# Altium schematic sheet PROC099B_LP Connector.SchDoc: LP Connector
size 431 x 279 mm; Date: Not shown in title block; ApprovedBy: Not shown in title block; CheckedBy: Not shown in title block; Author: Not shown in title block; CompanyName: Not shown in title block; DrawnBy: Adrian Ozer; Engineer: Not shown in title block; Organization: Not shown in title block; Address1: Not shown in title block; Address2: Not shown in title block; Address3: Not shown in title block; Address4: Not shown in title block; DocumentNumber: 11; Revision: Use project parameter SCH_Rev; SheetNumber: 11; SheetTotal: 16; PageSetup: Record=PageOptions|CenterHorizontal=True|CenterVertical=True|PrintScale=1.00|XCorrection=1.00|YCorrection=1.00|PrintKind=0|BorderSize=5000000|LeftOffset=0|BottomOffset=0|Orientation=2|PaperLength=1000|PaperWidth=1000|Scale=100|PaperSource=15|PrintQuality=600|MediaType=1|DitherType=10|PaperKind=Letter|PrintScaleMode=1; CurrentTime: Not shown in title block; CurrentDate: Not shown in title block; Time: Not shown in title block; DocumentFullPathAndName: Not shown in title block; DocumentName: Not shown in title block; ModifiedDate: Not shown in title block; ImagePath: Not shown in title block
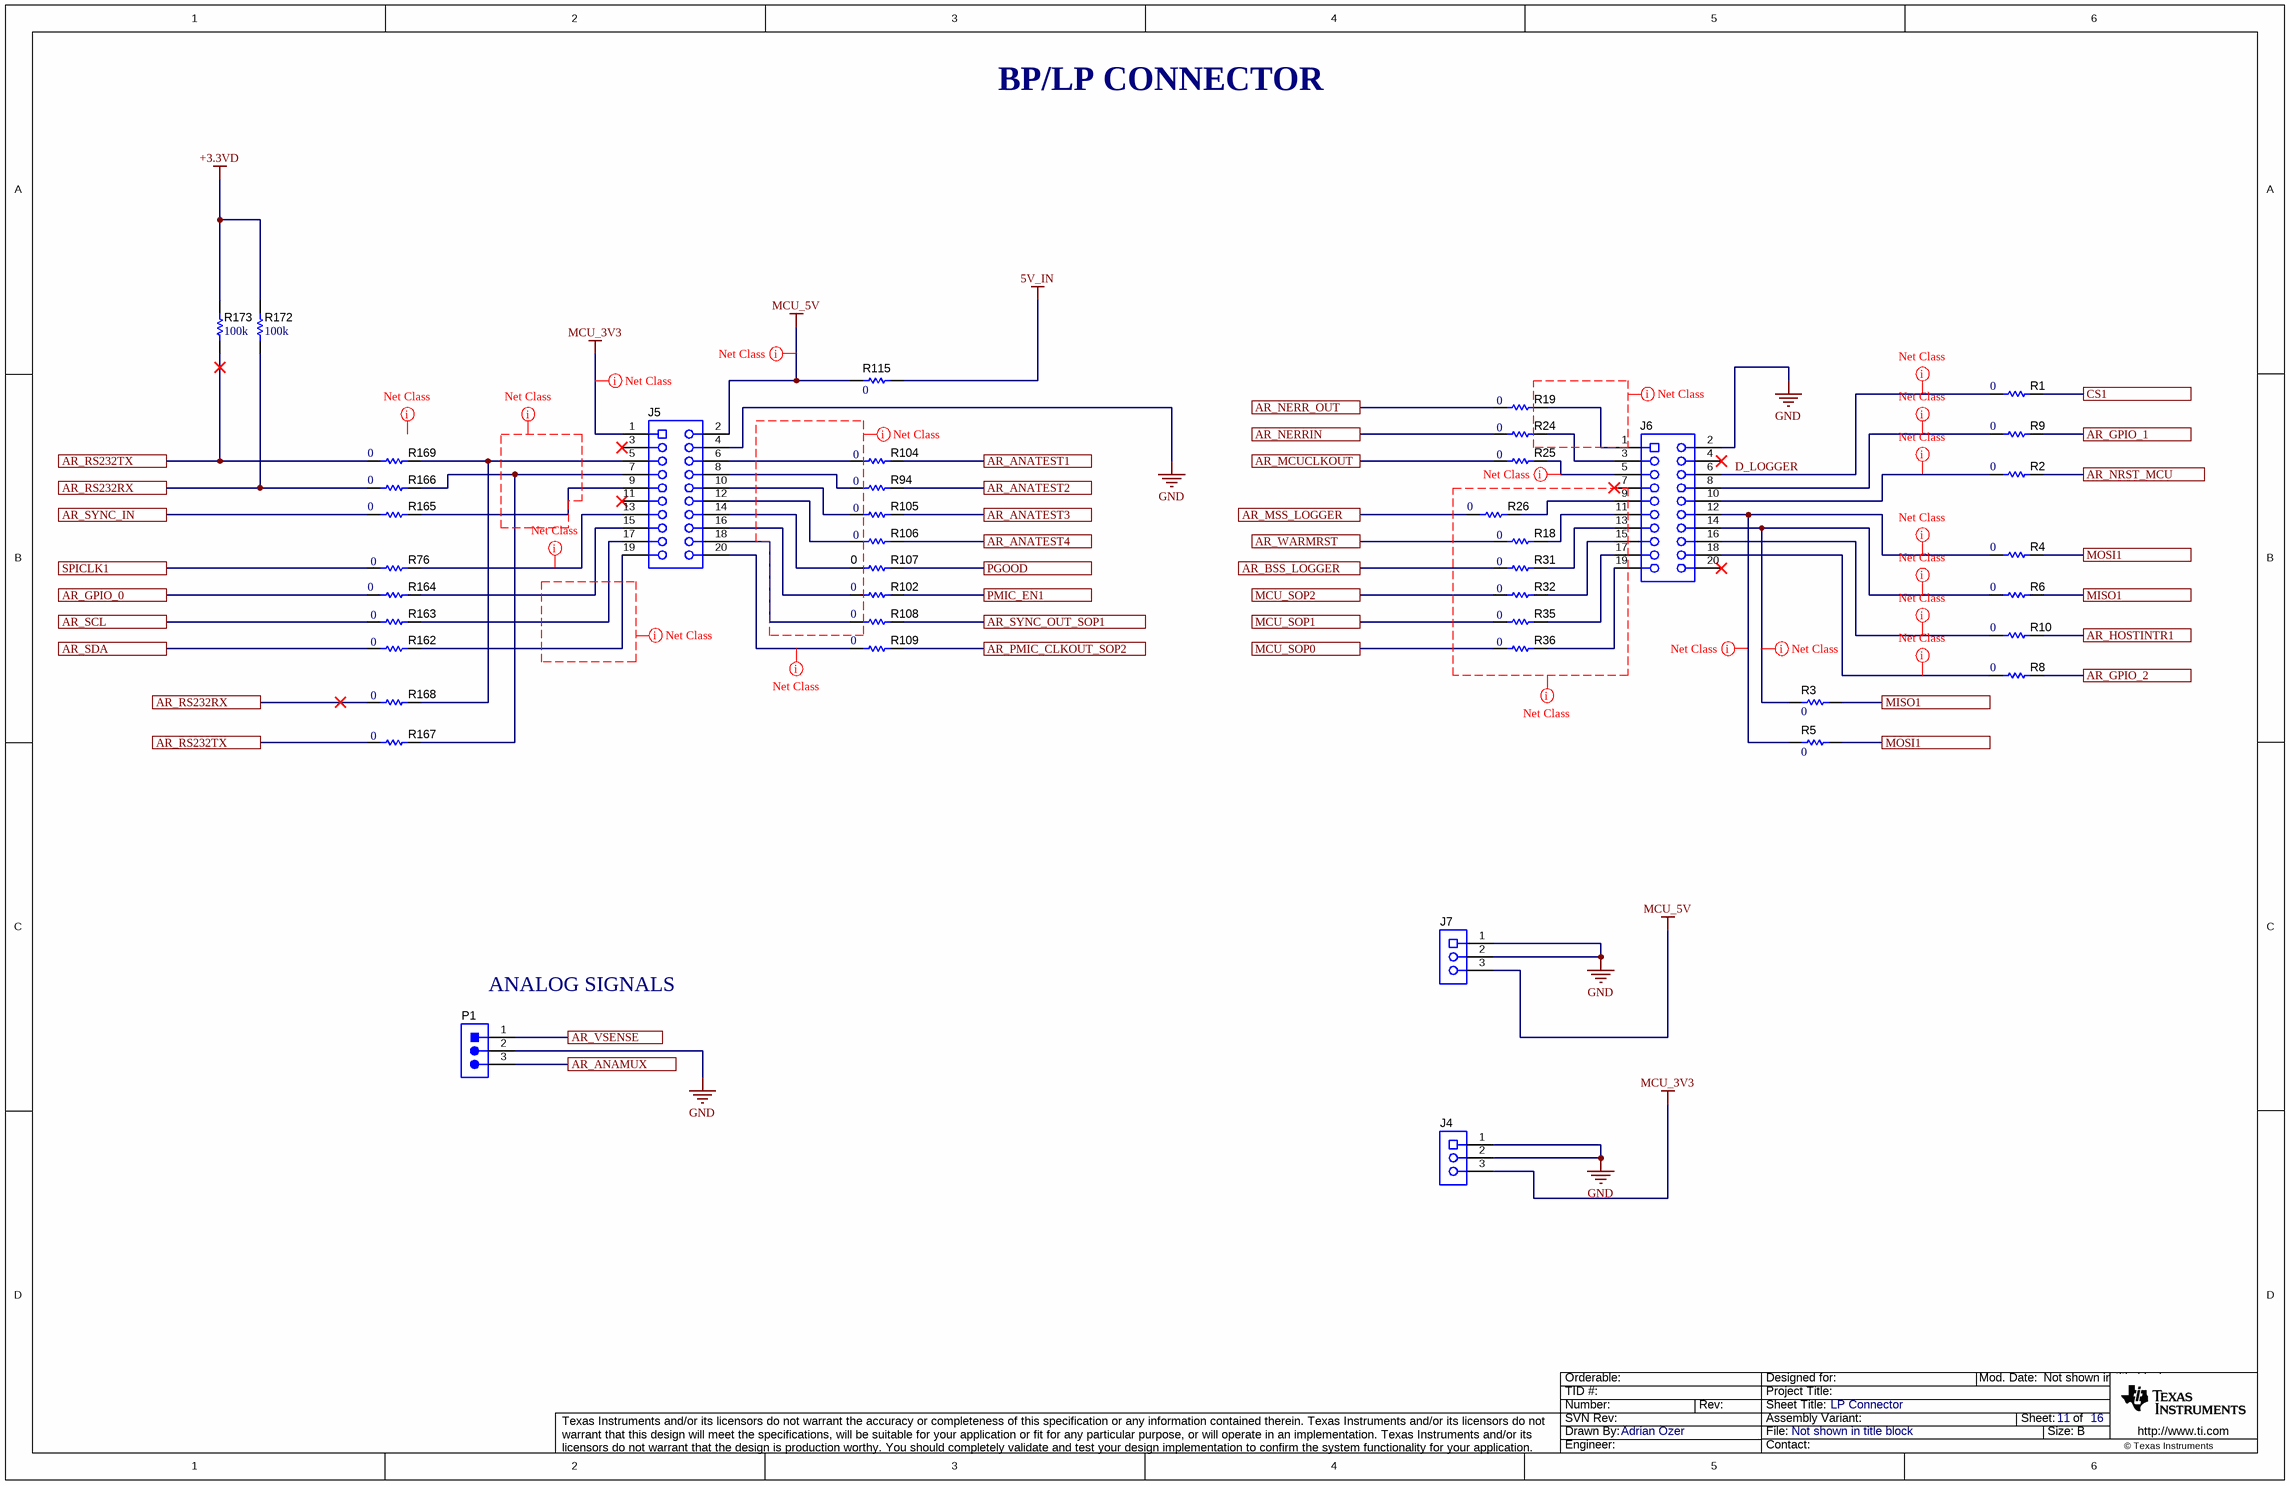
[diagram p0: PROC099B_LP Connector.SchDoc]

## Parts
J4  SSM-103-S-SV  [Samtec_SSM-103-x-SV]  (value not drawn)
J5  SSM-110-S-DV  [Samtec_SSM-110-x-DV]  (value not drawn)
J6  SSM-110-S-DV  [Samtec_SSM-110-x-DV]  (value not drawn)
J7  SSM-103-S-SV  [Samtec_SSM-103-x-SV]  (value not drawn)
P1  TSW-103-07-T-S  [Samtec_TSW-103-07-T-S]  (value not drawn)
R1  ValueDisplayed: 0  [0201_Silk]  (hidden comment: CRCW02010000Z0ED)
R2  ValueDisplayed: 0  [0201_Silk]  (hidden comment: CRCW02010000Z0ED)
R3  ValueDisplayed: 0  [0201_Silk]  (hidden comment: CRCW02010000Z0ED)
R4  ValueDisplayed: 0  [0201_Silk]  (hidden comment: CRCW02010000Z0ED)
R5  ValueDisplayed: 0  [0201_Silk]  (hidden comment: CRCW02010000Z0ED)
R6  ValueDisplayed: 0  [0201_Silk]  (hidden comment: CRCW02010000Z0ED)
R8  ValueDisplayed: 0  [0201_Silk]  (hidden comment: CRCW02010000Z0ED)
R9  ValueDisplayed: 0  [0201_Silk]  (hidden comment: CRCW02010000Z0ED)
R10  ValueDisplayed: 0  [0201_Silk]  (hidden comment: CRCW02010000Z0ED)
R18  ValueDisplayed: 0  [0201_Silk]  (hidden comment: CRCW02010000Z0ED)
R19  ValueDisplayed: 0  [0201_Silk]  (hidden comment: CRCW02010000Z0ED)
R24  ValueDisplayed: 0  [0201_Silk]  (hidden comment: CRCW02010000Z0ED)
R25  ValueDisplayed: 0  [0201_Silk]  (hidden comment: CRCW02010000Z0ED)
R26  ValueDisplayed: 0  [0201_Silk]  (hidden comment: CRCW02010000Z0ED)
R31  ValueDisplayed: 0  [0201_Silk]  (hidden comment: CRCW02010000Z0ED)
R32  ValueDisplayed: 0  [0201_Silk]  (hidden comment: CRCW02010000Z0ED)
R35  ValueDisplayed: 0  [0201_Silk]  (hidden comment: CRCW02010000Z0ED)
R36  ValueDisplayed: 0  [0201_Silk]  (hidden comment: CRCW02010000Z0ED)
R76  ValueDisplayed: 0  [0201_Silk]  (hidden comment: CRCW02010000Z0ED)
R94  ValueDisplayed: 0  [0201_Silk]  (hidden comment: CRCW02010000Z0ED)
R102  ValueDisplayed: 0  [0201_Silk]  (hidden comment: CRCW02010000Z0ED)
R104  ValueDisplayed: 0  [0201_Silk]  (hidden comment: CRCW02010000Z0ED)
R105  ValueDisplayed: 0  [0201_Silk]  (hidden comment: CRCW02010000Z0ED)
R106  ValueDisplayed: 0  [0201_Silk]  (hidden comment: CRCW02010000Z0ED)
R107  ValueDisplayed: 0  [0402L]  (hidden comment: ERJ-2GE0R00X)
R108  ValueDisplayed: 0  [0201_Silk]  (hidden comment: CRCW02010000Z0ED)
R109  ValueDisplayed: 0  [0201_Silk]  (hidden comment: CRCW02010000Z0ED)
R115  ValueDisplayed: 0  [2010]  (hidden comment: CRCW20100000Z0EF)
R162  ValueDisplayed: 0  [0201_Silk]  (hidden comment: CRCW02010000Z0ED)
R163  ValueDisplayed: 0  [0201_Silk]  (hidden comment: CRCW02010000Z0ED)
R164  ValueDisplayed: 0  [0201_Silk]  (hidden comment: CRCW02010000Z0ED)
R165  ValueDisplayed: 0  [0201_Silk]  (hidden comment: CRCW02010000Z0ED)
R166  ValueDisplayed: 0  [0201_Silk]  (hidden comment: CRCW02010000Z0ED)
R167  ValueDisplayed: 0  [0201_Silk]  (hidden comment: CRCW02010000Z0ED)
R168  ValueDisplayed: 0  [0201_Silk]  (hidden comment: CRCW02010000Z0ED)
R169  ValueDisplayed: 0  [0201_Silk]  (hidden comment: CRCW02010000Z0ED)
R172  ValueDisplayed: 100k  [0402L]  (hidden comment: CRCW0402100KFKED)
R173  ValueDisplayed: 100k  [0402L]  (hidden comment: CRCW0402100KFKED)

## Ports
AR_ANAMUX, AR_ANATEST1, AR_ANATEST2, AR_ANATEST3, AR_ANATEST4, AR_BSS_LOGGER, AR_GPIO_0, AR_GPIO_1, AR_GPIO_2, AR_HOSTINTR1, AR_MCUCLKOUT, AR_MSS_LOGGER, AR_NERR_OUT, AR_NERRIN, AR_NRST_MCU, AR_PMIC_CLKOUT_SOP2, AR_RS232RX, AR_RS232TX, AR_SCL, AR_SDA, AR_SYNC_IN, AR_SYNC_OUT_SOP1, AR_VSENSE, AR_WARMRST, CS1, MCU_SOP0, MCU_SOP1, MCU_SOP2, MISO1, MOSI1, PGOOD, PMIC_EN1, SPICLK1

## Nets
5V_IN: R115.2
+3.3VD: R172.2 R173.2
GND: J4.1 J4.2 J5.4 J6.2 J7.1 J7.2 P1.2
MCU_3V3: J4.3 J5.1
MCU_5V: J5.2 J7.3 R115.1
AR_ANAMUX: P1.3 ; port AR_ANAMUX
AR_ANATEST1: R104.2 ; port AR_ANATEST1
AR_ANATEST2: R94.2 ; port AR_ANATEST2
AR_ANATEST3: R105.2 ; port AR_ANATEST3
AR_ANATEST4: R106.2 ; port AR_ANATEST4
AR_BSS_LOGGER: R31.1 ; port AR_BSS_LOGGER
AR_GPIO_0: R164.1 ; port AR_GPIO_0
AR_GPIO_1: R9.2 ; port AR_GPIO_1
AR_GPIO_2: R8.2 ; port AR_GPIO_2
AR_HOSTINTR1: R10.2 ; port AR_HOSTINTR1
AR_MCUCLKOUT: R25.1 ; port AR_MCUCLKOUT
AR_MSS_LOGGER: R26.1 ; port AR_MSS_LOGGER
AR_NERR_OUT: R19.1 ; port AR_NERR_OUT
AR_NERRIN: R24.1 ; port AR_NERRIN
AR_NRST_MCU: R2.2 ; port AR_NRST_MCU
AR_PMIC_CLKOUT_SOP2: R109.2 ; port AR_PMIC_CLKOUT_SOP2
AR_RS232RX: R166.1 R168.1 R172.1 ; port AR_RS232RX
AR_RS232TX: R167.1 R169.1 R173.1 ; port AR_RS232TX
AR_SCL: R163.1 ; port AR_SCL
AR_SDA: R162.1 ; port AR_SDA
AR_SYNC_IN: R165.1 ; port AR_SYNC_IN
AR_SYNC_OUT_SOP1: R108.2 ; port AR_SYNC_OUT_SOP1
AR_VSENSE: P1.1 ; port AR_VSENSE
AR_WARMRST: R18.1 ; port AR_WARMRST
CS1: R1.2 ; port CS1
D_LOGGER: J6.6 R1.1
MCU_SOP0: R36.1 ; port MCU_SOP0
MCU_SOP1: R35.1 ; port MCU_SOP1
MCU_SOP2: R32.1 ; port MCU_SOP2
MISO1: R3.2 R6.2 ; port MISO1
MOSI1: R4.2 R5.2 ; port MOSI1
PGOOD: R107.2 ; port PGOOD
PMIC_EN1: R102.2 ; port PMIC_EN1
SPICLK1: R76.1 ; port SPICLK1
NetJ5_5: J5.5 R168.2 R169.2
NetJ5_6: J5.6 R104.1
NetJ5_7: J5.7 R166.2 R167.2
NetJ5_8: J5.8 R94.1
NetJ5_9: J5.9 R165.2
NetJ5_10: J5.10 R105.1
NetJ5_12: J5.12 R106.1
NetJ5_13: J5.13 R76.2
NetJ5_14: J5.14 R107.1
NetJ5_15: J5.15 R164.2
NetJ5_16: J5.16 R102.1
NetJ5_17: J5.17 R163.2
NetJ5_18: J5.18 R108.1
NetJ5_19: J5.19 R162.2
NetJ5_20: J5.20 R109.1
NetJ6_1: J6.1 R19.2
NetJ6_3: J6.3 R24.2
NetJ6_5: J6.5 R25.2
NetJ6_8: J6.8 R9.1
NetJ6_9: J6.9 R26.2
NetJ6_10: J6.10 R2.1
NetJ6_11: J6.11 R18.2
NetJ6_12: J6.12 R4.1 R5.1
NetJ6_13: J6.13 R31.2
NetJ6_14: J6.14 R3.1 R6.1
NetJ6_15: J6.15 R32.2
NetJ6_16: J6.16 R10.1
NetJ6_17: J6.17 R35.2
NetJ6_18: J6.18 R8.1
NetJ6_19: J6.19 R36.2

Not connected (* = marked no-connect by the designer): J5 3* 11*; J6 4* 7* 20*

## Layout directives
net class GENERAL: (no net found under the mark), NetJ6_8, NetJ6_10, NetJ6_18
net class CLK: NetJ5_20, NetJ6_5
net class PWR: MCU_3V3, MCU_5V
net class SPI: D_LOGGER, NetJ5_13, NetJ6_12, NetJ6_14, NetJ6_16

## Notes on the sheet
- BP/LP CONNECTOR
- (near P1) ANALOG SIGNALS
- Drawn By:
- SVN Rev:
- Number:
- TID #:
- Orderable:
- Rev:
- Sheet Title:
- File:
- Project Title:
- Designed for:
- Assembly Variant:
- Mod. Date:
- Sheet:
- Size:
- of
- B
- http://www.ti.com
- Texas Instruments and/or its licensors do not warrant the accuracy or completeness of this specification or any information contained therein. Texas Instruments and/or its licensors do not warrant that this design will meet the specifications, will be suitable for your application or fit for any particular purpose, or will operate in an implementation. Texas Instruments and/or its licensors do not warrant that the design is production worthy. You should completely validate and test your design implementation to confirm the system functionality for your application.
- Engineer:
- Contact:
- © Texas Instruments

## Library data of the parts
J4 J7 = CMP-0078183-1: Receptacle, 2.54mm, 3x1, Gold with Tin tail, SMT; Manufacturer: Samtec; Pitch_mm: 2.54; Gender: Female; Cert_CSA: Y; Voltage_V: 405V; Current_A: 5.2A; Row_Count: 1; CompType: Socket Strip; ComponentLink1Description: Datasheet URL; RoHS: Y; Supplier 1: Digi-Key; Cert_UL: Y; Orientation: Vertical; PackageReference: Receptacle, 2.54mm, 3x1, SMT; Color: Black; PartNumber: SSM-103-S-SV; PinCount: 3; Supplier Part Number 2: 11P7855; ContactFinish: Gold; Supplier 2: Newark; ComponentLink1URL: http://suddendocs.samtec.com/catalog_english/ssm_sm.pdf; MountType: SMT; Supplier Part Number 1: SAM1152-03-ND
J5 J6 = CMP-0078182-1: Receptacle, 2.54mm, 10x2, Gold with Tin tail, SMT; Manufacturer: Samtec; Pitch_mm: 2.54; Gender: Female; Cert_CSA: Y; Voltage_V: 405V; Current_A: 5.2A; Row_Count: 2; CompType: Socket Strip; ComponentLink1Description: Datasheet URL; RoHS: Y; Supplier 1: Digi-Key; Cert_UL: Y; Orientation: Vertical; PackageReference: Receptacle, 2.54mm, 10x2, SMT; Color: Black; PartNumber: SSM-110-S-DV; PinCount: 20; Supplier Part Number 2: 66H7361; ContactFinish: Gold; Supplier 2: Newark; RowSpacing_mm: 2.54; ComponentLink1URL: http://suddendocs.samtec.com/catalog_english/ssm_sm.pdf; MountType: SMT; Supplier Part Number 1: SAM1150-10-ND
P1 = CMP-0075530-2: Header, 2.54 mm, 3x1, Tin, TH; Manufacturer: Samtec; Pitch_mm: 2.54; Cert_VDE: N; Gender: Male; Cert_CSA: Y; Voltage_V: 550V; Green_REACh: Passed; Current_A: 6.3A; Green_Lifecycle: Active; Row_Count: 1; ComponentLink1Description: Datasheet URL; RoHS: Y; Supplier Part Number 3: 2035682; Supplier 1: Digi-Key; Cert_UL: Y; Orientation: Vertical; Green_EU RoHS: Passed; PackageReference: Header, 2.54 mm, 3x1, TH; Color: Black; PartNumber: TSW-103-07-T-S; PinCount: 3; Supplier Part Number 2: 12P1325; ContactFinish: Tin; Supplier 2: Newark; Cert_CULUS: N; Shrouded: N; ClassName: Header; ComponentLink1URL: http://www.samtec.com/ftppub/cpdf/TSW-XXX-XX-XXX-X-XX-XXX-MKT.pdf; CompType: Header; MountType: TH; Supplier Part Number 1: SAM1035-03-ND; Supplier 3: Farnell; Green_EU RoHS-2: Passed
R1-R6 R8-R10 R18 R19 R24-R26 R31 R32 R35 R36 R94 R102 R105 R106 R108 R109 R162-R169 = CMP-0027008-4: RES, 0, 5%, 0.05 W, 0201; Manufacturer: Vishay-Dale; Power_W: 50mW; TempCo: ppm/C; Value_Code: 0000; Value: 0; EIA_Code: E24; SizeX_mm: 0.6; SizeY_mm: 0.3; SizeZ_mm: 0.26; Value2: 0.05W; SizeArea_mm2: 0.18; AEC Qualified: N; AEC Category: Q200; RoHS: E; Value1: 5%; MountType: SMT; Supplier 1: Newark; PackageReference: 0201; Tolerance_%: 5%; Res_ohm: 0; CompType: Resistor; PartNumber: CRCW02010000Z0ED; ComponentLink1Description: Datasheet link; AEC Grade: N/A; Supplier Part Number 1: 72M6743; Technology: Thick Film; ComponentLink1URL: http://www.vishay.com/docs/20052/crcw0201e3.pdf
R76 R104 = CMP-0027008-4: RES, 0, 5%, 0.05 W, 0201; Manufacturer: Vishay-Dale; Power_W: 50mW; TempCo: ppm/C; Value_Code: 0000; Value: 0; EIA_Code: E24; SizeX_mm: 0.6; SizeY_mm: 0.3; SizeZ_mm: 0.26; Value2: 0.05W; SizeArea_mm2: 0.18; CompType: Resistor; AEC Qualified: N; AEC Category: Q200; RoHS: E; Value1: 5%; MountType: SMT; Supplier 1: Newark; PackageReference: 0201; Tolerance_%: 5%; Res_ohm: 0; PartNumber: CRCW02010000Z0ED; ComponentLink1Description: Datasheet link; AEC Grade: N/A; Supplier Part Number 1: 72M6743; Technology: Thick Film; ComponentLink1URL: http://www.vishay.com/docs/20052/crcw0201e3.pdf
R107 = CMP-0026992-2: RES, 0, 5%, 0.063 W, 0402; Manufacturer: Panasonic; Power_W: 63mW; TempCo: 600 ppm/C; Value_Code: 0000; U/M: EA; Value: 0; EIA_Code: E24; SizeX_mm: 1; SizeY_mm: 0.5; SizeZ_mm: 0.6; Value2: 0.063W; VDC_V: 50V; AEC Category: Q200; Supplier Part Number 2: 65T8307; Publisher: Texas Instruments; Supplier 2: Newark; Supplier Part Number 3: 667-ERJ-2GE0R00X; Supplier 3: Mouser; Published: 2008-06-26; RoHS: Y; Value1: 5%; MountType: SMT; Supplier 1: Digi-Key; PackageReference: 0402; Tolerance_%: 5%; Res_ohm: 0; SizeArea_mm2: 0.5; CompType: Resistor; LatestRevisionDate: 2017-03-09; PartNumber: ERJ-2GE0R00X; AEC Qualified: ?; ComponentLink1Description: Datasheet link; Supplier Part Number 1: P0.0JCT-ND; Technology: Thick Film; ComponentLink1URL: http://www.panasonic.com/industrial/components/pdf/AOA0000CE1.pdf
R115 = CMP-0016044-3: RES, 0, 5%, 0.75 W, AEC-Q200 Grade 0, 2010; Manufacturer: Vishay-Dale; Power_W: 750mW; TempCo: ppm/C; Value_Code: 0000; Value: 0; EIA_Code: E24; SizeX_mm: 5; SizeY_mm: 2.5; SizeZ_mm: 1.66; Value2: 0.75W; SizeArea_mm2: 12.5; AEC Qualified: Y; AEC Category: Q200; RoHS: E; Value1: 5%; MountType: SMT; Supplier 1: Digi-Key; PackageReference: 2010; Tolerance_%: 5%; Res_ohm: 0; CompType: Resistor; PartNumber: CRCW20100000Z0EF; ComponentLink1Description: Datasheet link; AEC Grade: 0; Supplier Part Number 1: 541-0.0WCT-ND; Technology: Thick Film; ComponentLink1URL: http://www.vishay.com/docs/20035/dcrcwe3.pdf
R172 R173 = CMP-0025950-3: RES, 100 k, 1%, 0.063 W, AEC-Q200 Grade 0, 0402; Manufacturer: Vishay-Dale; Power_W: 63mW; TempCo: 100 ppm/C; Value: 100k; EIA_Code: E96; SizeX_mm: 1; SizeY_mm: 0.5; SizeZ_mm: 0.6; Value2: 0.063W; AEC Qualified: Y; VDC_V: 50V; AEC Category: Q200; AEC Grade: 0; Supplier Part Number 2: 52K6607; Supplier 2: Newark; Supplier Part Number 3: 71-CRCW0402-100K-E3; Supplier 3: Mouser; Value_Code: 100k; RoHS: E; Value1: 1%; MountType: SMT; Supplier 1: Digi-Key; PackageReference: 0402; Tolerance_%: 1%; Res_ohm: 100k; SizeArea_mm2: 0.5; CompType: Resistor; PartNumber: CRCW0402100KFKED; ComponentLink1Description: Datasheet link; Supplier Part Number 1: 541-100KLCT-ND; Technology: Thick Film; ComponentLink1URL: http://www.vishay.com/docs/20035/dcrcwe3.pdf